# Altium schematic sheet motordriver-v5.0_trinamic-controller-dribbler.SchDoc
size B; SheetNumber: 5; SheetTotal: 13
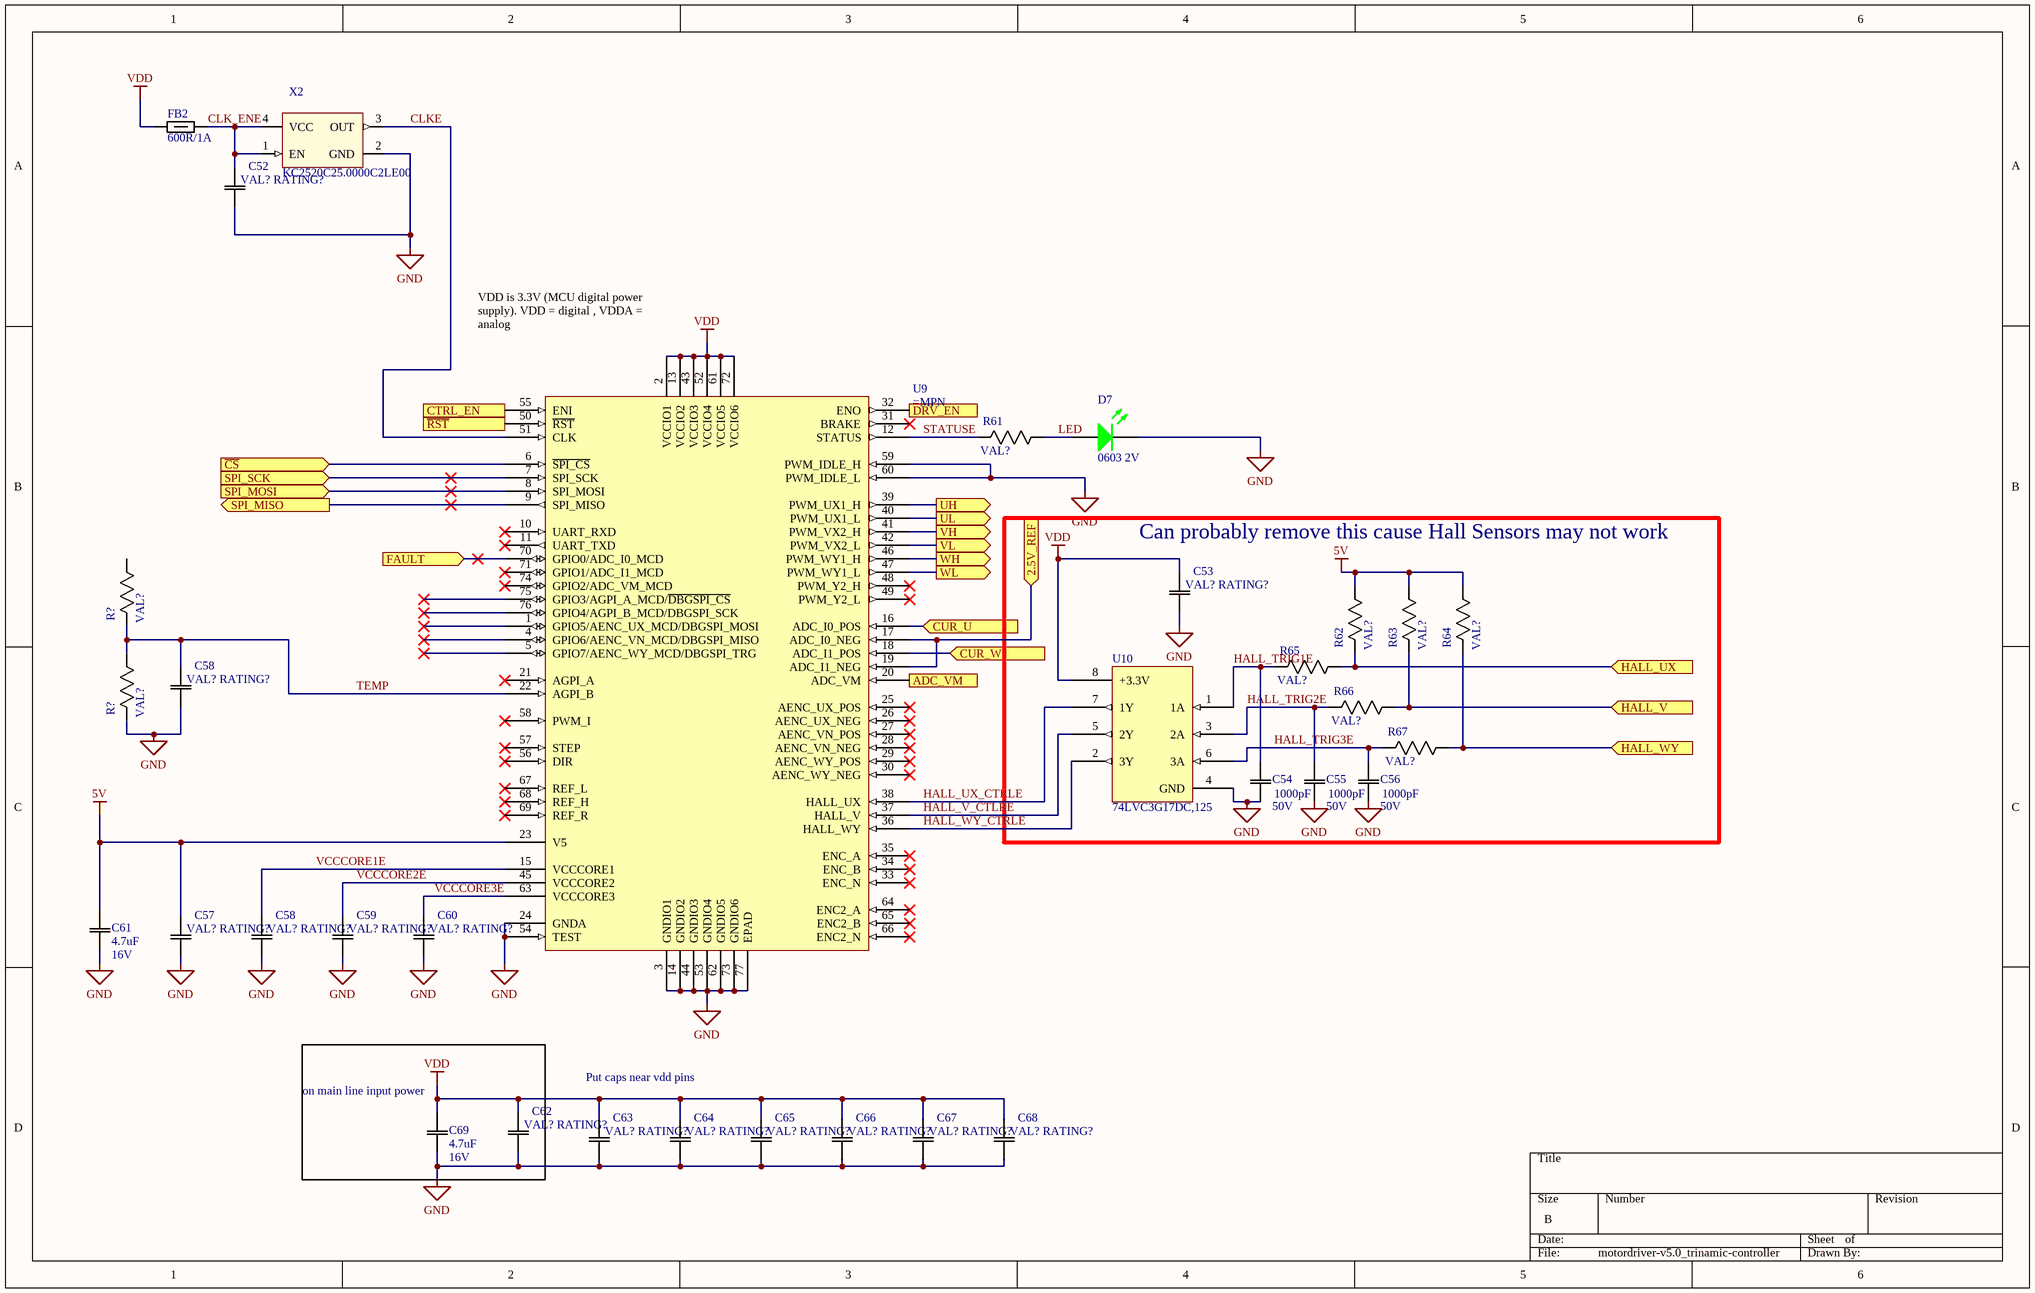
[diagram p0: motordriver-v5.0_trinamic-controller-dribbler.SchDoc]

## Parts
(Parts that share a designator on the sheet are numbered #1, #2 ... from top to bottom, then left to right.)
C52  VAL? RATING?  [0603]
C53  VAL? RATING?  [0603]
C54  value 1000pF  Rating: 50V  [0603]  (hidden comment: VAL? RATING?)
C55  value 1000pF  Rating: 50V  [0603]  (hidden comment: VAL? RATING?)
C56  value 1000pF  Rating: 50V  [0603]  (hidden comment: VAL? RATING?)
C57  VAL? RATING?  [0603]
C58#1  VAL? RATING?  [0603]
C58#2  VAL? RATING?  [0603]
C59  VAL? RATING?  [0603]
C60  VAL? RATING?  [0603]
C61  value 4.7uF  Rating: 16V  [0603]  (hidden comment: VAL? RATING?)
C62  VAL? RATING?  [0603]
C63  VAL? RATING?  [0603]
C64  VAL? RATING?  [0603]
C65  VAL? RATING?  [0603]
C66  VAL? RATING?  [0603]
C67  VAL? RATING?  [0603]
C68  VAL? RATING?  [0603]
C69  value 4.7uF  Rating: 16V  [0603]  (hidden comment: VAL? RATING?)
D7  0603 2V  [0603 - LED]
FB2  600R/1A  [0603]
R61  VAL?  [0603]
R62  VAL?  [0603]
R63  VAL?  [0603]
R64  VAL?  [0603]
R65  VAL?  [0603]
R66  VAL?  [0603]
R67  VAL?  [0603]
R?#1  VAL?  [0603]
R?#2  VAL?  [0603]
U9  (no value)  [QFN40P1050X650X90_HS-77N]
U10  74LVC3G17DC,125  [8-VSSOP]
X2  KC2520C25.0000C2LE00  [KC2520C25.0000C2LE00]

## Blocks framed on the sheet
Can probably remove this cause Hall Sensors may not work: C53-C56 R62-R67 U10
on main line input power: C62 C69

## Ports
2.5V_REF (in), ADC_VM (in), CTRL_EN (in), CUR_U (in), CUR_W (in), DRV_EN (out), FAULT (in), HALL_UX (in), HALL_V (in), HALL_WY (in), SPI_MISO (out), SPI_MOSI (in), SPI_SCK (in), UH (out), UL (out), VH (out), VL (out), WH (out), WL (out), ~{CS} (in), ~{RST} (in)

## Nets
5V: C57.2(C2) C61.2(C2) R62.1(R1) R63.1(R1) R64.1(R1) U9.23(V5)
GND: C52.1(C1) C53.1(C1) C54.1(C1) C55.1(C1) C56.1(C1) C57.1(C1) C58#1.1(C1) C58#2.1(C1) C59.1(C1) C60.1(C1) C61.1(C1) C62.1(C1) C63.1(C1) C64.1(C1) C65.1(C1) C66.1(C1) C67.1(C1) C68.1(C1) C69.1(C1) D7.2(K) R?#2.2(R2) U9.3(GNDIO1) U9.14(GNDIO2) U9.24(GNDA) U9.44(GNDIO3) U9.53(GNDIO4) U9.54(TEST) U9.59(PWM_IDLE_H) U9.60(PWM_IDLE_L) U9.62(GNDIO5) U9.73(GNDIO6) U9.77(EPAD) U10.4(GND) X2.2(GND)
VDD: C53.2(C2) C62.2(C2) C63.2(C2) C64.2(C2) C65.2(C2) C66.2(C2) C67.2(C2) C68.2(C2) C69.2(C2) FB2.1 U9.2(VCCIO1) U9.13(VCCIO2) U9.43(VCCIO3) U9.52(VCCIO4) U9.61(VCCIO5) U9.72(VCCIO6) U10.8(+3.3V)
2.5V_REF: U9.17(ADC_I0_NEG) U9.19(ADC_I1_NEG) ; port 2.5V_REF
ADC_VM: U9.20(ADC_VM) ; port ADC_VM
~{CS}: U9.6(~{SPI_CS}) ; port ~{CS}
CLK_ENE: C52.2(C2) FB2.2 X2.1(EN) X2.4(VCC)
CLKE: U9.51(CLK) X2.3(OUT)
CTRL_EN: U9.55(ENI) ; port CTRL_EN
CUR_U: U9.16(ADC_I0_POS) ; port CUR_U
CUR_W: U9.18(ADC_I1_POS) ; port CUR_W
DRV_EN: U9.32(ENO) ; port DRV_EN
FAULT: U9.70(GPIO0/ADC_I0_MCD) ; port FAULT
HALL_TRIG1E: C54.2(C2) R65.2(R2) U10.1(1A)
HALL_TRIG2E: C55.2(C2) R66.2(R2) U10.3(2A)
HALL_TRIG3E: C56.2(C2) R67.2(R2) U10.6(3A)
HALL_UX: R62.2(R2) R65.1(R1) ; port HALL_UX
HALL_UX_CTRLE: U9.38(HALL_UX) U10.7(1Y)
HALL_V: R63.2(R2) R66.1(R1) ; port HALL_V
HALL_V_CTLRE: U9.37(HALL_V) U10.5(2Y)
HALL_WY: R64.2(R2) R67.1(R1) ; port HALL_WY
HALL_WY_CTRLE: U9.36(HALL_WY) U10.2(3Y)
LED: D7.1(A) R61.1(R1)
~{RST}: U9.50(~{RST}) ; port ~{RST}
SPI_MISO: U9.9(SPI_MISO) ; port SPI_MISO
SPI_MOSI: U9.8(SPI_MOSI) ; port SPI_MOSI
SPI_SCK: U9.7(SPI_SCK) ; port SPI_SCK
STATUSE: R61.2(R2) U9.12(STATUS)
TEMP: C58#1.2(C2) R?#1.2(R2) R?#2.1(R1) U9.22(AGPI_B)
UH: U9.39(PWM_UX1_H) ; port UH
UL: U9.40(PWM_UX1_L) ; port UL
VCCCORE1E: C58#2.2(C2) U9.15(VCCCORE1)
VCCCORE2E: C59.2(C2) U9.45(VCCCORE2)
VCCCORE3E: C60.2(C2) U9.63(VCCCORE3)
VH: U9.41(PWM_VX2_H) ; port VH
VL: U9.42(PWM_VX2_L) ; port VL
WH: U9.46(PWM_WY1_H) ; port WH
WL: U9.47(PWM_WY1_L) ; port WL

Not connected (* = marked no-connect by the designer): R?#1 1(R1); U9 1(GPIO5/AENC_UX_MCD/DBGSPI_MOSI)* 4(GPIO6/AENC_VN_MCD/DBGSPI_MISO)* 5(GPIO7/AENC_WY_MCD/DBGSPI_TRG)* 10(UART_RXD)* 11(UART_TXD)* 21(AGPI_A)* 25(AENC_UX_POS)* 26(AENC_UX_NEG)* 27(AENC_VN_POS)* 28(AENC_VN_NEG)* 29(AENC_WY_POS)* 30(AENC_WY_NEG)* 31(BRAKE)* 33(ENC_N)* 34(ENC_B)* 35(ENC_A)* 48(PWM_Y2_H)* 49(PWM_Y2_L)* 56(DIR)* 57(STEP)* 58(PWM_I)* 64(ENC2_A)* 65(ENC2_B)* 66(ENC2_N)* 67(REF_L)* 68(REF_H)* 69(REF_R)* 71(GPIO1/ADC_I1_MCD)* 74(GPIO2/ADC_VM_MCD)* 75(GPIO3/AGPI_A_MCD/~{DBGSPI_CS})* 76(GPIO4/AGPI_B_MCD/DBGSPI_SCK)*

## Notes on the sheet
- (near U9) VDD is 3.3V (MCU digital power supply). VDD = digital , VDDA = analog
- Put caps near vdd pins

## Library data of the parts
C52 C53 C57 C58#1 C58#2 C59 C60 C63-C68 = CAP 100nF 50V: Default Symbol for Capacitors; Manufacturer Part Number 1: CC0603KPX7R9BB104; Value: 100nF; Tolerance: 10%; Rating: 50V; Temperature Coefficient: X7R; Part Number: CAP 100nF 50V; Supplier 1: Digi-Key; Supplier Part Number 1: 311-3567-1-ND; Manufacturer Part Number 2: 0805J0500104KJT; Supplier 2: Digi-Key; Supplier Part Number 2: 1608-1458-1-ND
C54-C56 = CAP 1000pF 50V: Default Symbol for Capacitors; Manufacturer Part Number 1: 06035C102K4Z2A / 06035C102K4Z2A; Tolerance: 10%; Temperature Coefficient: X7R; Part Number: CAP 1000pF 50V; Supplier 1: Digi-Key; Supplier Part Number 1: 478-6342-1-ND; Manufacturer Part Number 2: 08055C102KAT2A; Supplier 2: Digi-Key; Supplier Part Number 2: 478-1371-1-ND
C61 C69 = CAP 4.7uF 16V: Default Symbol for Capacitors; Manufacturer Part Number 1: C1608X5R1C475K080AE; Tolerance: 10%; Temperature Coefficient: X5R; Part Number: CAP 4.7uF 16V; Supplier 1: Digi-Key; Supplier Part Number 1: 445-175225-1-ND; Manufacturer Part Number 2: C2012X5R1C475K085AB; Supplier 2: Digi-Key; Supplier Part Number 2: 445-14382-1-ND
C62 = CAP 470nF 50V: Default Symbol for Capacitors; Manufacturer Part Number 1: C1608X7R1H474K080AC; Value: 470nF; Tolerance: 10%; Rating: 50V; Temperature Coefficient: X7R; Part Number: CAP 470nF 50V; Supplier 1: Digi-Key; Supplier Part Number 1: 445-5952-1-ND; Manufacturer Part Number 2: CL21B474KBFNNNG; Supplier 2: Digi-Key; Supplier Part Number 2: 1276-6482-1-ND
D7 = LED GREEN SMD 0603: LED Uni-Color Green 574nm 2-Pin Chip LED T/R; Manufacturer Part Number: LTST-C190KGKT; Current Rating: 20mA; Supplier 1: Digi-Key; Supplier Part Number 1: 160-1435-1-ND; Part Number: LED GREEN SMD 0603; Supplier URL 1: https://www.digikey.ca/en/products/detail/lite-on-inc/LTST-C190KGKT/386815?s=N4IgTCBcDaIIwDYAMBaOAWAzAVjSgcgCIgC6AvkA; Pin Count: 2; Voltage Rating - DC: 2V
FB2 = FERRITE BEAD 200 MOHM 0603 1LN: WURTH ELEKTRONIK - 742792651 - Ferrite Bead, 0603 [1608 Metric], 600 ohm, 1 A, WE-CBF Series, 0.2 ohm, &#177; 25%; Manufacturer Part Number: 742792651-220-R; Value: 600R/1A @ 100 MHz; Supplier 1: Digi-Key; Supplier Part Number 1: 732-1593-1-ND; Part Number: FERRITE BEAD 200 MOHM 0603 1LN; Supplier URL 1: https://www.digikey.ca/en/products/detail/w%C3%BCrth-elektronik/742792651/1638997?s=N4IgTCBcDaIOwGYwFoCMBWAnAtyByAIiALoC%2BQA
R61 = RES 75.0 1/8W - 5%: Default Resistor Symbol; Manufacturer Part Number 1: RMCF0805JT75R0; Value: 75; Power (Watts): 0.125W; Tolerance: 5%; Tolerance 2: 1%; Package: 0805; Part Number: RES 75.0 1/8W - 5%; Supplier 1: Digi-Key; Supplier Part Number 1: RMCF0805JT75R0CT-ND; Manufacturer Part Number 2: RNCP0603FTD75R0; Supplier 2: Digi-Key; Supplier Part Number 2: RNCP0603FTD75R0CT-ND
R62-R67 = RES 4.7k 1/8W - 5%: Default Resistor Symbol; Value: 1; Power (Watts): 0.125W; Tolerance: 5%; Package: 0805; Part Number: RES 4.7k 1/8W - 5%
R?#1 R?#2 = RES 4.7k 1/8W - 1%: Default Resistor Symbol; Value: 1; Power (Watts): 0.125W; Tolerance: 5%; Package: 0805; Part Number: RES 4.7k 1/8W - 1%
U9 = TMC4671: Motor Driver, -40 To 125Deg C Rohs Compliant: Yes; Manufacturer Part Number: TMC4671-LA; Supplier 1: Digi-Key; Supplier Part Number 1: 1460-TMC4671-LA-ND; Part Number: TMC4671; Suppler URL 1: https://www.digikey.ca/en/products/detail/trinamic-motion-control-gmbh/TMC4671-LA/12174669?s=N4IgTCBcDaIIwBYBsAGAtAFQLIGFkHY40AZAQTQDkAREAXQF8g
U10 = IC 74LVC3G17DC,125: IC BUFFER TRIPLE SCHMITT TRIGGER 5.5V VSSOP-8; Manufacturer: Nexperia; Supplier 1: Newark; Manufacturer Part Number: 74LVC3G17DC,125; RoHS: Yes; Category: Logic Gates; Stock 1: 2995; Pricing 1: 1=0.84800, 5=0.83500, 10=0.70800, 25=0.62000, 50=0.53200, 100=0.44500, 250=0.41300, 500=0.38300, 1000=0.35200 (USD); RoHS Compliant: Yes; Supplier Part Number 1: 33AC1281
X2 = XTAL OSC 25MHz 3.3V: Oscillator XO 25MHz ±15ppm 15pF CMOS 55% 2.5V/3.3V 4-Pin Mini-CSMD T/R; Frequency: 32.768kHz; Load Capacitance: 12.5pF; Supplier 1: Digi-Key; Manufacturer Part Number: KC2520C25.0000C2LE00; Supplier Part Number 1: 1253-1254-6-ND; Part Number: XTAL OSC 25MHz 3.3V; Supplier URL 1: https://www.digikey.ca/en/products/detail/kyocera-avx/KC2520C25-0000C2LE00/4867084?s=N4IgTCBcDaIIxgKwGYC0DEBZUDZUDkAREAXQF8g